# EAGLE design dawn (EAGLE 7.5.0)
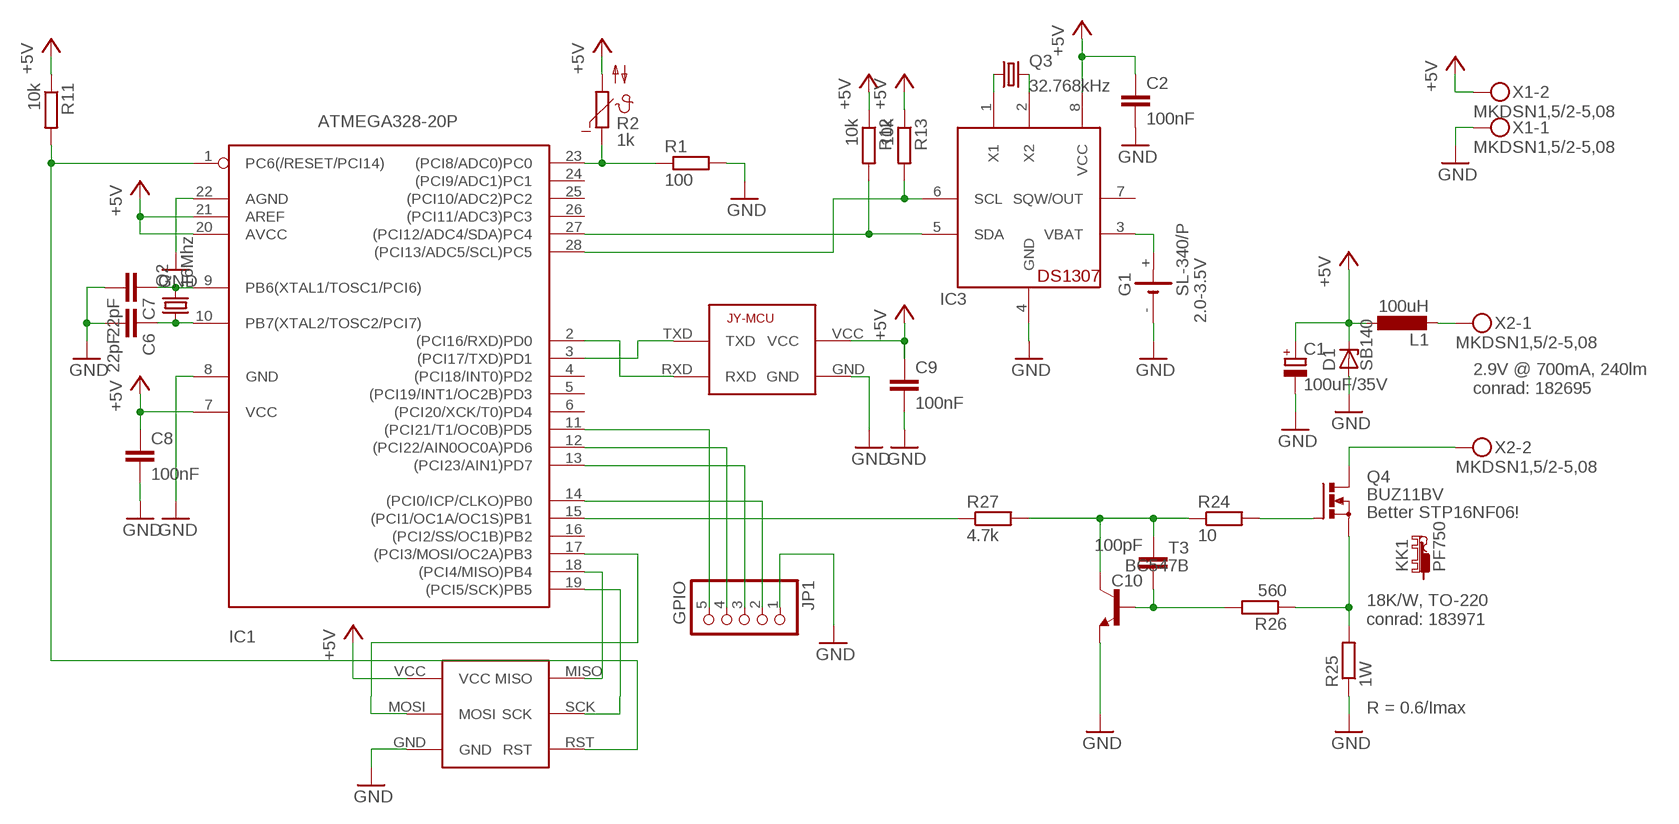
[diagram p0: schematic, sheet 1]

## Parts
C1  100uF/35V  CPOL-EUE5-6  [E5-6]
C2  100nF  C-EU025-025X050  [C025-025X050]
C6  22pF  C-EU050-025X075  [C050-025X075]
C7  22pF  C-EU025-025X050  [C025-025X050]
C8  100nF  C-EU025-025X050  [C025-025X050]
C9  100nF  C-EU025-025X050  [C025-025X050]
C10  100pF  C-EU025-025X050  [C025-025X050]
D1  SB140  ZENER-DIODEDO35Z10  [DO35Z10]
G1  SL-340/P  [BEL/P]
IC1  ATMEGA328-20P  [DIL28-3]
IC3  DS1307  [DIL08]
JP1  GPIO  PINHD-1X5  [1X05]
KK1  PF750  [PF752]
L1  100uH  L-EU6000-XXX-RC  [6000-XXXX-RC]
Q2  16Mhz  CRYSTALHC18U-V  [HC18U-V]
Q3  32.768kHz  CRYSTALTC26V  [TC26V]
Q4  BUZ11BV  [TO220BV]
R1  100  R-EU_0204/2V  [0204V]
R2  1k  B57164  [B57164]
R11  10k  R-EU_0207/10  [0207/10]
R12  10k  R-EU_0204/5  [0204/5]
R13  10k  R-EU_0204/2V  [0204V]
R24  10  R-EU_0204/7  [0204/7]
R25  1W  R-EU_0411/12  [0411/12]
R26  560  R-EU_0207/17  [0207/17]
R27  4.7k  R-EU_0207/10  [0207/10]
T3  BC547B  -NPN-TO92-EBC  [TO92-EBC]
U$1  JY-MCU  [JY-MCU]
U$2  AVR-ISP  [AVR-ISP]
X1  MKDSN1,5/2-5,08  [MKDSN1,5/2-5,08]
X2  MKDSN1,5/2-5,08  [MKDSN1,5/2-5,08]

## Nets
+5V: C1.+ C2.1 C8.1 C9.1 D1.C IC1.7(VCC) IC1.20(AVCC) IC1.21(AREF) IC3.8(VCC) L1.1 R2.2 R11.1 R12.1 R13.1 U$1.VCC U$2.VCC X1.2
GND: C1.- C2.2 C6.2 C7.2 C8.2 C9.2 D1.A G1.- IC1.8(GND) IC1.22(AGND) IC3.4(GND) JP1.1 R1.2 R25.1 T3.E U$1.GND U$2.GND X1.1
N$1: IC1.15((PCI1/OC1A/OC1S)PB1) R27.1
N$2: IC1.18((PCI4/MISO)PB4) U$2.MISO
N$3: IC1.19((PCI5/SCK)PB5) U$2.SCK
N$4: IC1.1(PC6(/RESET/PCI14)) R11.2 U$2.RST
N$5: IC1.17((PCI3/MOSI/OC2A)PB3) U$2.MOSI
N$6: IC1.12((PCI22/AIN0OC0A)PD6) JP1.4
N$7: IC1.11((PCI21/T1/OC0B)PD5) JP1.5
N$8: IC1.13((PCI23/AIN1)PD7) JP1.3
N$9: IC1.14((PCI0/ICP/CLKO)PB0) JP1.2
N$10: IC1.23((PCI8/ADC0)PC0) R1.1 R2.1
N$11: L1.2 X2.1
N$12: C7.1 IC1.9(PB6(XTAL1/TOSC1/PCI6)) Q2.2
N$13: IC3.2(X2) Q3.2
N$14: IC3.1(X1) Q3.1
N$16: Q4.D X2.2
N$18: C6.1 IC1.10(PB7(XTAL2/TOSC2/PCI7)) Q2.1
N$19: IC1.28((PCI13/ADC5/SCL)PC5) IC3.6(SCL) R13.2
N$21: IC1.27((PCI12/ADC4/SDA)PC4) IC3.5(SDA) R12.2
N$22: G1.+ IC3.3(VBAT)
N$23: IC1.3((PCI17/TXD)PD1) U$1.TXD
N$24: IC1.2((PCI16/RXD)PD0) U$1.RXD
N$37: Q4.G R24.2
N$39: Q4.S R25.2 R26.1
N$40: C10.1 R26.2 T3.B
N$41: C10.2 R24.1 R27.2 T3.C
Unconnected: IC1.4((PCI18/INT0)PD2) IC1.5((PCI19/INT1/OC2B)PD3) IC1.6((PCI20/XCK/T0)PD4) IC1.16((PCI2/SS/OC1B)PB2) IC1.24((PCI9/ADC1)PC1) IC1.25((PCI10/ADC2)PC2) IC1.26((PCI11/ADC3)PC3) IC3.7(SQW/OUT)

## Notes on the sheet
- 2.0-3.5V
- 2.9V @ 700mA, 240lm
  conrad: 182695
- Better STP16NF06!
- 18K/W, TO-220
  conrad: 183971
- R = 0.6/Imax

## Library data of the parts
C1 = rcl:CPOL-EU: POLARIZED CAPACITOR, European symbol
C2 C6-C10 = rcl:C-EU: CAPACITOR, European symbol
D1 = diode:ZENER-DIODE: Z-Diode
G1 = battery:SL-340/P: LI BATTERY Sonnenschein SL-340
IC1 = atmega328:ATMEGA328*P: MICROCONTROLLER 32 kBytes FLASH 2 kBytes SRAM 1 kBytes EEPROM USART 8-channel 10 bit ADC
IC3 = adafruit:DS1307: DS1307 Real time clock (RTC) with battery backup ability. Talk to it via i2c
JP1 = pinhead:PINHD-1X5: PIN HEADER
KK1 = heatsink:PF750: HEATSINK manufacturer Thermalloy/distributor Farnell
L1 = rcl:L-EU: INDUCTOR, European symbol
Q2 Q3 = adafruit:CRYSTAL: CRYSTAL; OC_FARNELL: unknown; OC_NEWARK: unknown
Q4 = transistor-power:BUZ11: N-CHANNEL MOS FET
R1 R11-R13 R24-R27 = rcl:R-EU_: RESISTOR, European symbol
R2 = ptc-ntc:B57164: SIEMENS NTC; MPN: B57164K474K52; OC_FARNELL: 9753451; OC_NEWARK: 29M3118
T3 = transistor-neu-to92:*-NPN-: NPN Transistror
U$1 = jy-mcu:JY-MCU
U$2 = isp:AVR-ISP
X1 X2 = con-phoenix-508:MKDSN1,5/2-5,08: MKDSN 1,5/ 2-5,08 Printklemme Nennstrom: 13,5 A Nennspannung: 250 V Rastermaß: 5,08 mm Polzahl: 2 Anschlussart: Schraubanschluss Montage: Löten Anschlussrichtung Leiter/Platine: 0 ° Artikelnummer: 1729128 Source: http://eshop.phoenixcontact.com .. 1729128.pdf

## Board
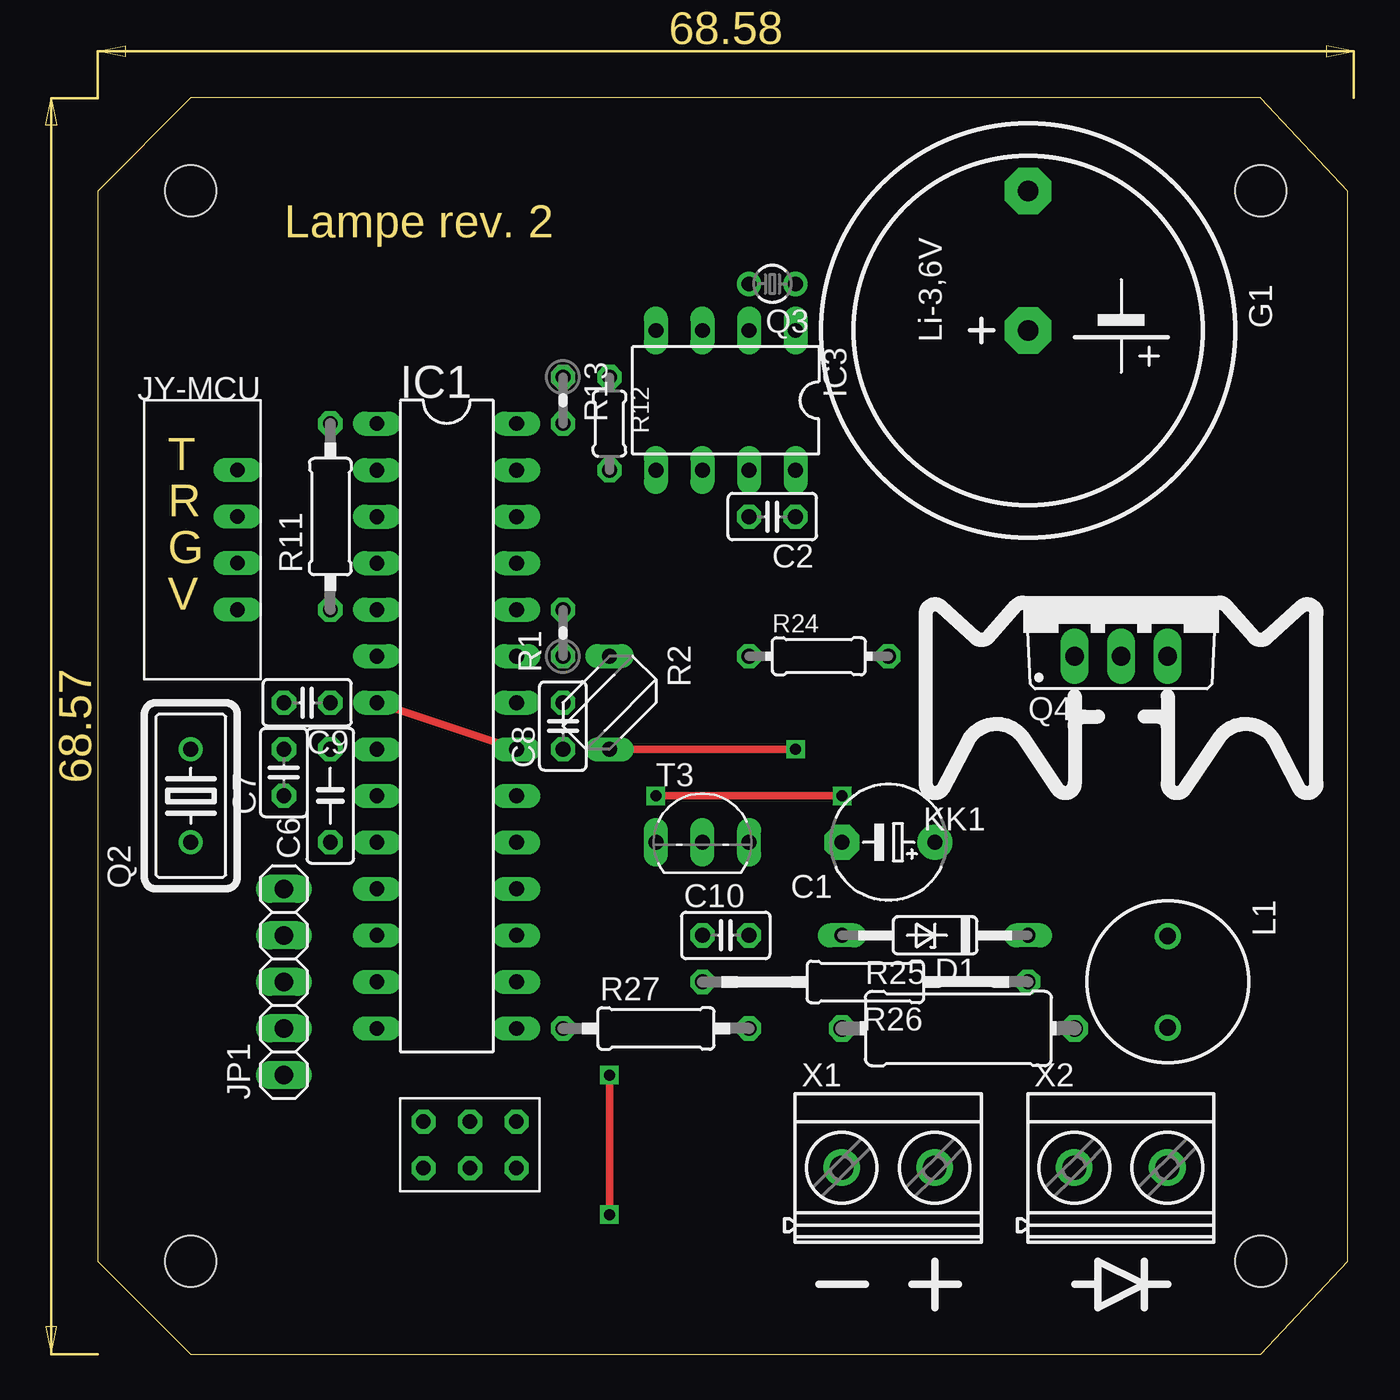
[diagram p1: board, top side]
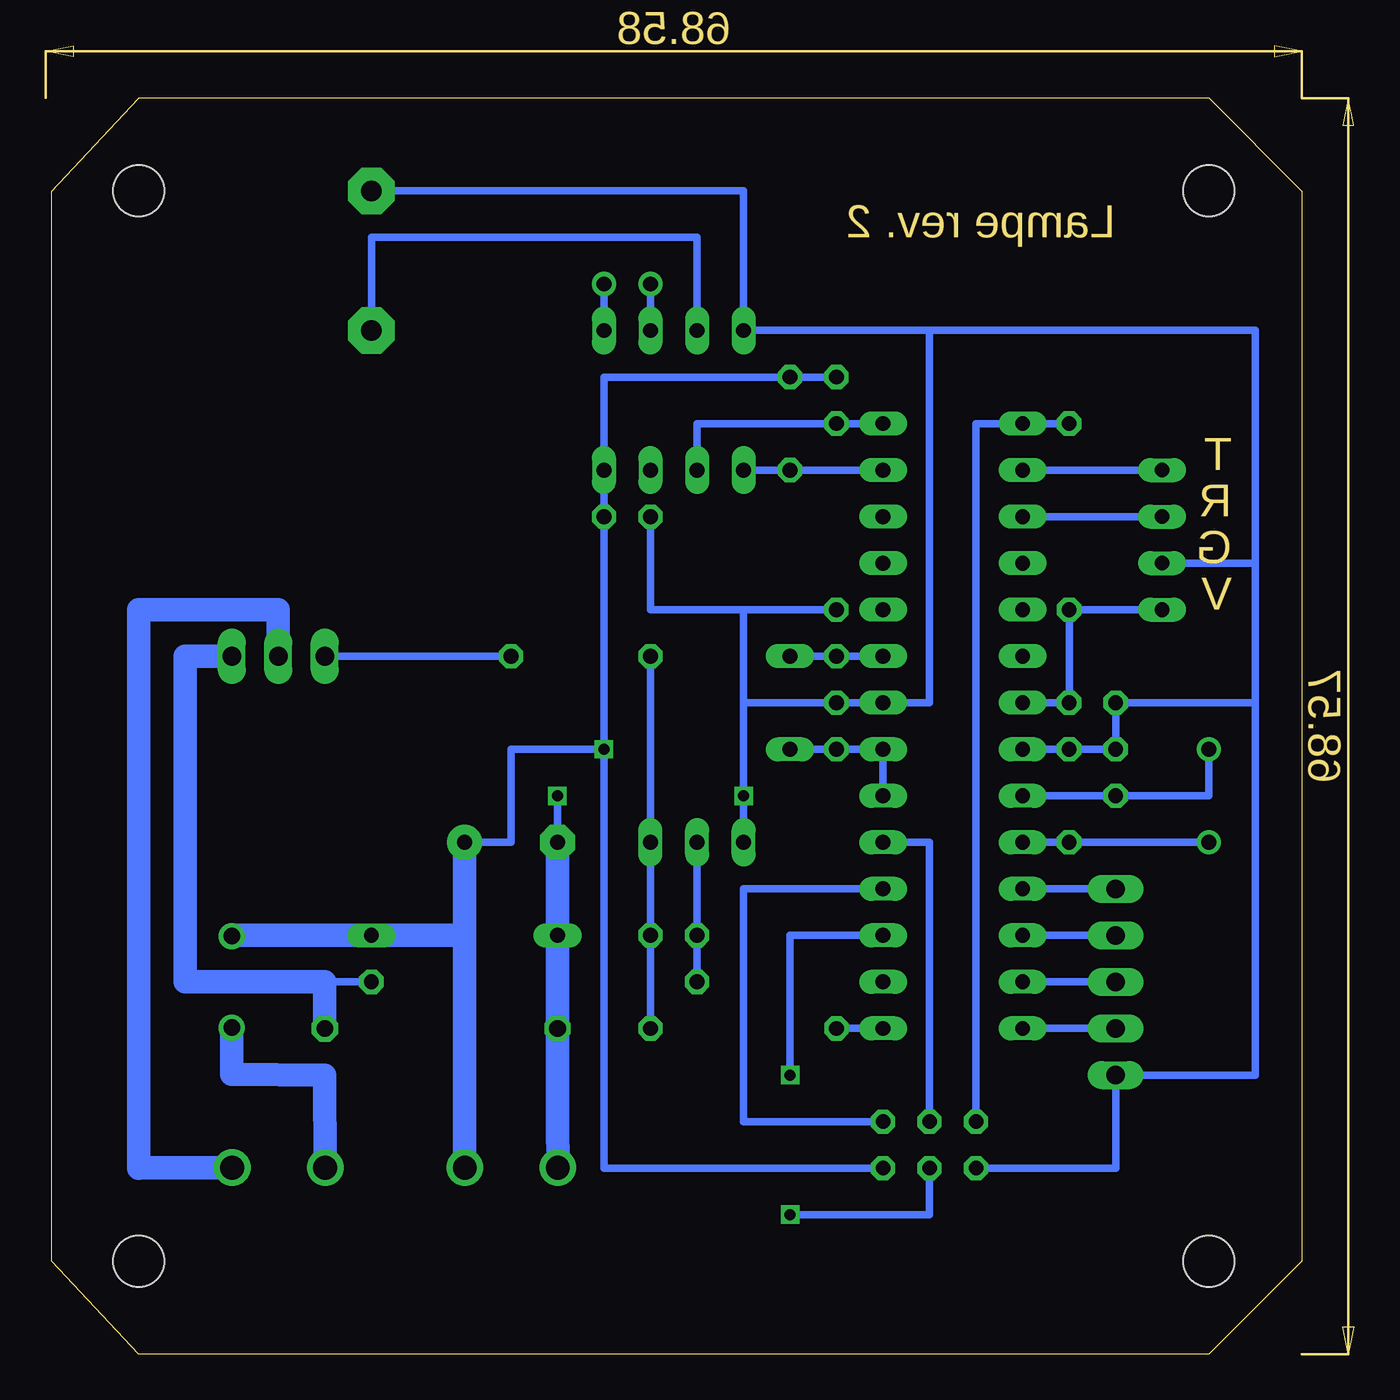
[diagram p2: board, bottom side, seen from below]

Size 68.25 x 68.58 mm. Coordinates in mm from the lower left corner, seen from the top.
Outline: 0,5.08 5.08,0 63.5,0 68.25,5.08 68.25,63.49 63.5,68.57 63.5,68.58 5.08,68.58 0,63.49 0,5.08
Copper layers (1*16): Top 0.035mm / dielectric 1.5mm / Bottom 0.035mm
Design rules "default": minimum track width 10mil, minimum drill 24mil, track to track 8mil, track to pad 8mil, pad to pad 8mil, via to via 8mil, smd to smd 8mil, copper to edge 40mil, drill to drill 8mil, minimum pad ring 10mil, minimum via ring 8mil, stop-mask expansion 4mil, vias tented up to drill 0mil, thermal gap 10mil
Holes 2.8 mm at 5.08,63.5 63.5,63.5 63.5,5.08 5.08,5.08

### Footprints (pad centres in the part's own frame; a part is rotated, then mirrored left to right if it is on the bottom)
E5-6 = drill 0.813 pad 1.905: + -2.54,0 | drill 0.813 pad 1.905 octagon: - 2.54,0
C025-025X050 = drill 0.813 octagon: 1 -1.27,0; 2 1.27,0
C050-025X075 = drill 0.813 octagon: 1 -2.54,0; 2 2.54,0
DO35Z10 = drill 0.813 long: A 5.08,0; C -5.08,0
BEL/P = drill 1.118 pad 2.54 octagon: + 0,0; - -7.62,0
DIL28-3 = drill 0.813 long: 1 -16.51,-3.81; 2 -13.97,-3.81; 3 -11.43,-3.81; 4 -8.89,-3.81; 5 -6.35,-3.81; 6 -3.81,-3.81; 7 -1.27,-3.81; 8 1.27,-3.81; 9 3.81,-3.81; 10 6.35,-3.81; 11 8.89,-3.81; 12 11.43,-3.81; 13 13.97,-3.81; 14 16.51,-3.81; 15 16.51,3.81; 16 13.97,3.81; 17 11.43,3.81; 18 8.89,3.81; 19 6.35,3.81; 20 3.81,3.81; 21 1.27,3.81; 22 -1.27,3.81; 23 -3.81,3.81; 24 -6.35,3.81; 25 -8.89,3.81; 26 -11.43,3.81; 27 -13.97,3.81; 28 -16.51,3.81
DIL08 = drill 0.813 long: 1 -3.81,-3.81; 2 -1.27,-3.81; 3 1.27,-3.81; 4 3.81,-3.81; 5 3.81,3.81; 6 1.27,3.81; 7 -1.27,3.81; 8 -3.81,3.81
1X05 = drill 1.016 long: 1 -5.08,0; 2 -2.54,0; 3 0,0; 4 2.54,0; 5 5.08,0
6000-XXXX-RC = drill 0.9 pad 1.422: 1 -2.5,0; 2 2.5,0
HC18U-V = drill 0.813: 1 -2.54,0; 2 2.54,0
TC26V = drill 0.813: 1 -1.27,0; 2 1.27,0
TO220BV = drill 1.016 long: D 0,-2.54; G -2.54,-2.54; S 2.54,-2.54
0204V = drill 0.813 octagon: 1 -1.27,0; 2 1.27,0
B57164 = drill 0.813 long: 1 -2.54,0; 2 2.54,0
0207/10 = drill 0.813 octagon: 1 -5.08,0; 2 5.08,0
0204/5 = drill 0.813 octagon: 1 -2.54,0; 2 2.54,0
0204/7 = drill 0.813 octagon: 1 -3.81,0; 2 3.81,0
0411/12 = drill 0.914 octagon: 1 -6.35,0; 2 6.35,0
0207/17 = drill 0.813 octagon: 1 -8.89,0; 2 8.89,0
TO92-EBC = drill 0.813 long: B 0,-1.27; C 2.54,-1.27; E -2.54,-1.27
JY-MCU = drill 0.8 long: GND 0,1.27; RXD 0,-3.81; TXD 0,-1.27; VCC 0,3.81
AVR-ISP = drill 0.8 octagon: GND 2.54,1.27; MISO -2.54,-1.27; MOSI 0,1.27; RST 2.54,-1.27; SCK 0,-1.27; VCC -2.54,1.27
MKDSN1,5/2-5,08 = drill 1.3 pad 2: 1 -2.561,0.025; 2 2.519,0.025

### Placement (x,y rotation side)
C1  43.18,27.94 180 top
C2  36.83,45.72 180 top
C6  12.7,30.48 90 top
C7  10.16,31.75 90 top
C8  25.4,34.29 90 top
C9  11.43,35.56 180 top
C10  34.29,22.86 0 top
D1  45.72,22.86 180 top
G1  50.8,55.88 270 top
IC1  19.05,34.29 270 top
IC3  34.29,52.07 180 top
JP1  10.16,20.32 90 top
KK1  55.88,40.64 0 top
L1  58.42,20.32 270 top
Q2  5.08,30.48 90 top
Q3  36.83,58.42 180 top
Q4  55.88,40.64 0 top
R1  25.4,39.37 90 top
R2  27.94,35.56 270 top
R11  12.7,45.72 90 top
R12  27.94,50.8 270 top
R13  25.4,52.07 270 top
R24  39.37,38.1 0 top
R25  46.99,17.78 0 top
R26  41.91,20.32 180 top
R27  30.48,17.78 0 top
T3  33.02,29.21 0 top
U$1  7.62,44.45 180 top
U$2  20.32,11.43 180 top
X1  43.18,10.16 0 top
X2  55.88,10.16 0 top

### Tracks (layer width: path | path; a pad name or v marks a point on that pad's centre or on a via)
+5V  (via drill 0.6)
  Top 0.406: IC1.21 IC1.7 | v38.1,33.02 R2.2
  Bottom 0.406: U$1.VCC R11.1 C9.1 IC1.7 | IC1.20 IC1.21 C8.1 R2.2 | R13.1 R12.1 38.1,53.34 IC3.8 C2.1 v38.1,33.02 | v38.1,33.02 38.1,10.16 U$2.VCC | v38.1,33.02 43.18,33.02 43.18,27.94 C1.+
  Bottom 1.27: 45.72,22.86 45.72,10.18 X1.2 | 45.72,22.86 C1.+ | L1.1 58.42,22.86 D1.C 45.72,22.86
  other vias: 27.94,33.02
GND  (via drill 0.6)
  Top 0.406: v30.48,30.48 v40.64,30.48
  Bottom 0.406: T3.E v30.48,30.48 30.48,35.56 | C7.2 C6.2 IC1.8 C7.2 | C7.2 C9.2 2.54,35.56 | 20.32,55.88 20.32,35.56 IC1.22 C8.2 30.48,35.56 | 20.32,55.88 2.54,55.88 2.54,43.18 | G1.- 30.48,63.5 IC3.4 20.32,55.88 | 2.54,35.56 2.54,15.24 JP1.1 10.16,10.16 U$2.GND | 2.54,35.56 2.54,43.18 | U$1.GND 2.54,43.18 | C1.- v40.64,30.48 | R1.2 30.48,40.64 | 30.48,40.64 30.48,35.56 | C2.2 35.56,40.64 30.48,40.64
  Bottom 1.27: 40.64,12.73 R25.1 D1.A C1.- | X1.1 40.64,12.73 | 40.64,12.73 40.64,12.7
N$1
  Bottom 0.406: IC1.15 R27.1
N$2
  Bottom 0.406: IC1.18 30.48,25.4 30.48,12.7 U$2.MISO
N$3
  Bottom 0.406: IC1.19 20.32,27.94 U$2.SCK
N$4
  Bottom 0.406: R11.2 IC1.1 17.78,50.8 17.78,49.53 17.78,29.21 | 17.78,29.21 17.78,27.94 U$2.RST | 17.78,29.21 17.78,30.48 17.78,29.21
N$5  (via drill 0.6)
  Top 0.406: v27.94,7.62 v27.94,15.24
  Bottom 0.406: IC1.17 27.94,22.86 27.94,16.51 | 27.94,16.51 v27.94,15.24 | v27.94,15.24 27.94,16.51 | 27.94,16.51 v27.94,15.24 | v27.94,7.62 20.32,7.62 U$2.MOSI | v27.94,15.24 27.94,16.51
N$6
  Bottom 0.406: IC1.12 JP1.4
N$7
  Bottom 0.406: IC1.11 JP1.5
N$8
  Bottom 0.406: IC1.13 JP1.3
N$9
  Bottom 0.406: IC1.14 JP1.2
N$10
  Bottom 0.406: IC1.23 R1.1 R2.1
N$11
  Bottom 1.27: L1.2 58.42,15.28 53.34,15.24 53.32,10.16 X2.1
N$12
  Bottom 0.406: IC1.9 C7.1 5.08,30.48 Q2.2
N$13
  Bottom 0.406: Q3.2 IC3.2
N$14
  Bottom 0.406: IC3.1 Q3.1
N$16
  Bottom 1.27: X2.2 63.5,10.18 | 63.5,10.18 63.5,10.16 | 63.5,10.18 63.5,40.64 55.88,40.64 Q4.D
N$18
  Bottom 0.406: Q2.1 C6.1 IC1.10
N$19
  Bottom 0.406: IC3.6 33.02,50.8 IC1.28 R13.2
N$21
  Bottom 0.406: IC3.5 R12.2 IC1.27
N$22
  Bottom 0.406: IC3.3 33.02,60.96 50.8,60.96 G1.+
N$23
  Bottom 0.406: IC1.3 11.43,45.72 U$1.TXD
N$24
  Bottom 0.406: IC1.2 12.7,48.26 U$1.RXD
N$37
  Bottom 0.406: Q4.G R24.2
N$39
  Bottom 0.406: R26.1 53.34,20.32
  Bottom 1.27: Q4.S 60.96,38.1 60.96,20.32 53.34,20.32 R25.2
N$40
  Bottom 0.406: R26.2 T3.B C10.1
N$41
  Bottom 0.406: R27.2 C10.2 T3.C R24.1

### Text on the board
Dimension: Lampe rev. 2 | T | R | G | V